# Altium schematic sheet 02-DAC.schdoc
size 307 x 218 mm; Symbol: muban; Device: muban; @Project Name: 12345678; @Create Date: 2025-07-10; @Schematic Name: Mini Oscilloscope; @Page Count: 5; @Update Date: 2025-07-10; @Update Time: 15:23:32; @Page Name: 02-DAC; @Page No: 2; @Create Time: 07:22:24; @Board Name: Base Board; Title Block Position: 3; Width: 1170; Height: 825; Region Start: 1; X Region Count: 6; Y Region Count: 4; Blade Width: 10; Description: 模拟题模板
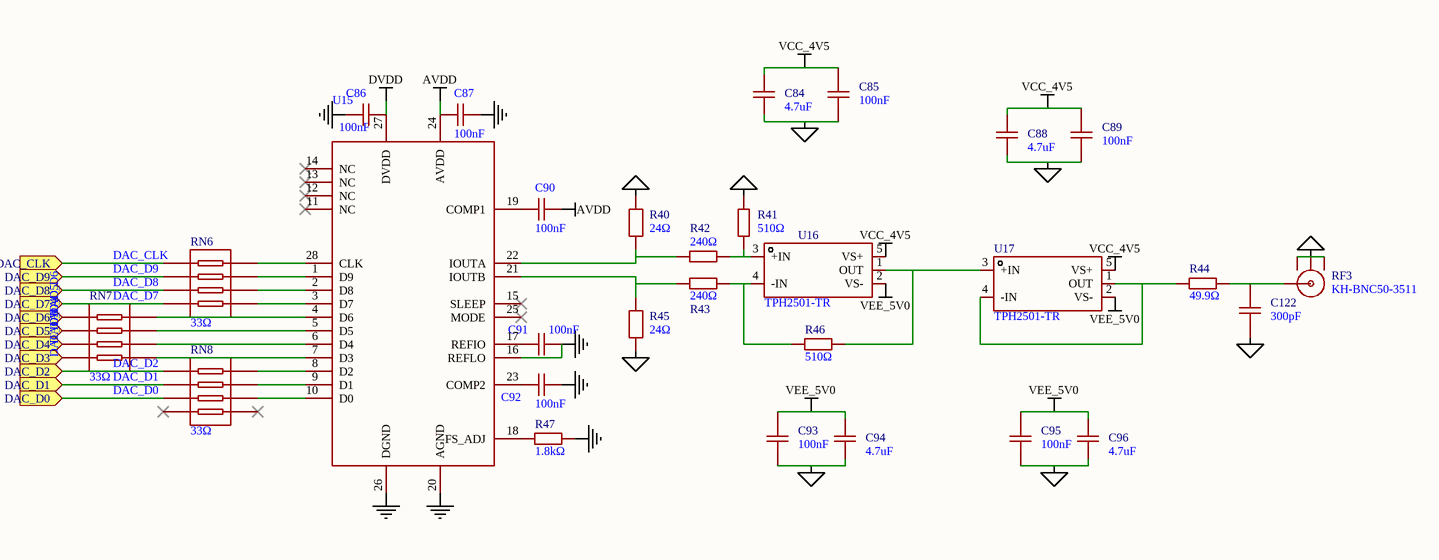
[diagram p0: 02-DAC.schdoc]

## Parts
C84  4.7uF  [C0603]
C85  100nF  [C0603]
C86  100nF  [C0603]
C87  100nF  [C0603]
C88  4.7uF  [C0603]
C89  100nF  [C0603]
C90  100nF  [C0603]
C91  100nF  [C0603]
C92  100nF  [C0603]
C93  100nF  [C0603]
C94  4.7uF  [C0603]
C95  100nF  [C0603]
C96  4.7uF  [C0603]
C122  300pF  [C0603]
R40  24Ω  [R0603]
R41  510Ω  [R0603]
R42  240Ω  [R0603]
R43  240Ω  [R0603]
R44  49.9Ω  [R0603]
R45  24Ω  [R0603]
R46  510Ω  [R0603]
R47  1.8kΩ  [R0603]
RF3  KH-BNC50-3511  [ANT-TH_KH-BNC50-3511]
RN6  33Ω  [RES-ARRAY-SMD_0603-8P-L3.2-W1.6-BL]
RN7  33Ω  [RES-ARRAY-SMD_0603-8P-L3.2-W1.6-BL]
RN8  33Ω  [RES-ARRAY-SMD_0603-8P-L3.2-W1.6-BL]
U15  (no value)  [TSSOP-28_L9.7-W4.4-P0.65-LS6.4-TR]
U16  TPH2501-TR  [SOT-23-5_L3.0-W1.7-P0.95-LS2.8-BR]
U17  TPH2501-TR  [SOT-23-5_L3.0-W1.7-P0.95-LS2.8-BR]

## Ports
DAC_CLK (in), DAC_D0 (in), DAC_D1 (in), DAC_D2 (in), DAC_D3 (in), DAC_D4 (in), DAC_D5 (in), DAC_D6 (in), DAC_D7 (in), DAC_D8 (in), DAC_D9 (in)

## Nets
AGND: C84.1 C85.1 C88.1 C89.1 C93.1 C94.1 C95.1 C96.1 C122.1 R40.2 R41.2 R45.1 RF3.2 RF3.3 RF3.4
AVDD: C87.2 C90.1 U15.24(AVDD)
DVDD: C86.2 U15.27(DVDD)
GND: C86.1 C87.1 C91.1 C92.1 R47.2 U15.16(REFLO) U15.20(AGND) U15.26(DGND)
VCC_4V5: C84.2 C85.2 C88.2 C89.2 U16.5(VS+) U17.5(VS+)
VEE_5V0: C93.2 C94.2 C95.2 C96.2 U16.2(VS-) U17.2(VS-)
DAC_CLK: RN6.5 ; port DAC_CLK
DAC_D0: RN8.3 ; port DAC_D0
DAC_D1: RN8.2 ; port DAC_D1
DAC_D2: RN8.1 ; port DAC_D2
DAC_D3: RN7.4 ; port DAC_D3
DAC_D4: RN7.3 ; port DAC_D4
DAC_D5: RN7.2 ; port DAC_D5
DAC_D6: RN7.1 ; port DAC_D6
DAC_D7: RN6.8 ; port DAC_D7
DAC_D8: RN6.7 ; port DAC_D8
DAC_D9: RN6.6 ; port DAC_D9
NetC90_2: C90.2 U15.19(COMP1)
NetC91_2: C91.2 U15.17(REFIO)
NetC92_2: C92.2 U15.23(COMP2)
NetC122_2: C122.2 R44.2 RF3.1(OUT)
NetR40_1: R40.1 R42.1 U15.22(IOUTA)
NetR41_1: R41.1 R42.2 U16.3(+IN)
NetR43_1: R43.1 R45.2 U15.21(IOUTB)
NetR43_2: R43.2 R46.1 U16.4(-IN)
NetR44_1: R44.1 U17.1(OUT) U17.4(-IN)
NetR46_2: R46.2 U16.1(OUT) U17.3(+IN)
NetR47_1: R47.1 U15.18(FS_ADJ)
NetRN6_1: RN6.1 U15.3(D7)
NetRN6_2: RN6.2 U15.2(D8)
NetRN6_3: RN6.3 U15.1(D9)
NetRN6_4: RN6.4 U15.28(CLK)
NetRN7_5: RN7.5 U15.7(D3)
NetRN7_6: RN7.6 U15.6(D4)
NetRN7_7: RN7.7 U15.5(D5)
NetRN7_8: RN7.8 U15.4(D6)
NetRN8_6: RN8.6 U15.10(D0)
NetRN8_7: RN8.7 U15.9(D1)
NetRN8_8: RN8.8 U15.8(D2)

Not connected (* = marked no-connect by the designer): RN8 4* 5*; U15 11(NC)* 12(NC)* 13(NC)* 14(NC)* 15(SLEEP)* 25(MODE)*

## Notes on the sheet
- 1
- 2
- 3
- 4
- 5
- 6
- A
- B
- C
- D

## Library data of the parts
C84 C88 C94 C96 = CL10A475KO8NNNC: Manufacturer: SAMSUNG(三星); Add into BOM: yes; Tolerance: ±10%; Voltage Rated: 16V; Temperature Coefficient: X5R; Symbol: CL10A475KO8NNNC; Device: CL10A475KO8NNNC; LCSC Part Name: 4.7uF ±10% 16V; Supplier Part: C19666; Manufacturer Part: CL10A475KO8NNNC; Supplier Footprint: 0603; JLCPCB Part Class: Basic Part; Datasheet: https://atta.szlcsc.com/upload/public/pdf/source/20160218/1457707763339.pdf; Supplier: LCSC; Convert to PCB: yes; Value: 4.7uF
C85 C89 C93 C95 = CGA0603X7R104K500JT: Manufacturer: HRE(芯声); Symbol: CC0603KRX7R9BB104; Add into BOM: yes; Tolerance: ±10%; Voltage Rated: 50V; Temperature Coefficient: X7R; Device: CGA0603X7R104K500JT; LCSC Part Name: 100nF ±10% 50V; Supplier Part: C6119867; Manufacturer Part: CGA0603X7R104K500JT; Supplier Footprint: 0603; JLCPCB Part Class: Extended Part; Datasheet: https://atta.szlcsc.com/upload/public/pdf/source/20250103/C44077DA9E7B3EFAE02F22B6D3D1CBC9.pdf; Supplier: LCSC; Convert to PCB: yes; Value: 100nF; Voltage Rating: 50V
C86 C87 C90-C92 = CGA0603X7R104K500JT: Manufacturer: HRE(芯声); Symbol: GCM155R71C104KA40D; Add into BOM: yes; Tolerance: ±10%; Voltage Rated: 50V; Temperature Coefficient: X7R; Device: CGA0603X7R104K500JT; LCSC Part Name: 100nF ±10% 50V; Supplier Part: C6119867; Manufacturer Part: CGA0603X7R104K500JT; Supplier Footprint: 0603; JLCPCB Part Class: Extended Part; Datasheet: https://atta.szlcsc.com/upload/public/pdf/source/20250103/C44077DA9E7B3EFAE02F22B6D3D1CBC9.pdf; Supplier: LCSC; Convert to PCB: yes; Value: 100nF; Voltage Rating: 50V
C122 = CC0603JRNPO9BN301: Manufacturer: YAGEO(国巨); Add into BOM: yes; Tolerance: ±5%; Voltage Rated: 50V; Temperature Coefficient: NP0; Symbol: CC0603JRNPO9BN301; Device: CC0603JRNPO9BN301; LCSC Part Name: 300pF ±5% 50V; Supplier Part: C519401; Manufacturer Part: CC0603JRNPO9BN301; Supplier Footprint: 0603; JLCPCB Part Class: 扩展库; Datasheet: https://atta.szlcsc.com/upload/public/pdf/source/20200423/C519401_2047077801E3794C35D33CD0926CFD8F.pdf; Supplier: LCSC; Convert to PCB: yes; Value: 300pF
R40 R45 = FRC0603F24R0TS: Manufacturer: FOJAN(富捷); Add into BOM: yes; Tolerance: ±1%; Power(Watts): 100mW; Overload Voltage (Max): 75V; Temperature Coefficient: ±100ppm/℃; Symbol: FRC0603F24R0TS; Device: FRC0603F24R0TS; LCSC Part Name: 24Ω ±1% 100mW 厚膜电阻; Supplier Part: C2907018; Manufacturer Part: FRC0603F24R0TS; Supplier Footprint: 0603; JLCPCB Part Class: 扩展库; Datasheet: https://atta.szlcsc.com/upload/public/pdf/source/20211221/925EC7D7225764EE0046F22065062C87.pdf; Supplier: LCSC; Convert to PCB: yes; Type: 厚膜电阻; Value: 24Ω; Operating Temperature Range: -55℃~+155℃
R41 R46 = 0603WAF5100T5E: Manufacturer: UNI-ROYAL(厚声); Add into BOM: yes; Tolerance: ±1%; Power(Watts): 100mW; Overload Voltage (Max): 75V; Temperature Coefficient: ±100ppm/℃; Symbol: 0603WAF5100T5E; Device: 0603WAF5100T5E; LCSC Part Name: 510Ω ±1% 100mW 厚膜电阻; Supplier Part: C23193; Manufacturer Part: 0603WAF5100T5E; Supplier Footprint: 0603; JLCPCB Part Class: 基础库; Datasheet: https://atta.szlcsc.com/upload/public/pdf/source/20200306/C422600_1E6D84923E4A46A82E41ADD87F860B5C.pdf; Supplier: LCSC; Convert to PCB: yes; Type: 厚膜电阻; Value: 510Ω; Operating Temperature Range: -55℃~+155℃
R42 R43 = 0603WAF2400T5E: Manufacturer: UNI-ROYAL(厚声); Add into BOM: yes; Tolerance: ±1%; Power(Watts): 100mW; Overload Voltage (Max): 75V; Temperature Coefficient: ±100ppm/℃; Symbol: 0603WAF2400T5E; Device: 0603WAF2400T5E; LCSC Part Name: 240Ω ±1% 100mW 厚膜电阻; Supplier Part: C23350; Manufacturer Part: 0603WAF2400T5E; Supplier Footprint: 0603; JLCPCB Part Class: 扩展库; Datasheet: https://atta.szlcsc.com/upload/public/pdf/source/20200306/C422600_1E6D84923E4A46A82E41ADD87F860B5C.pdf; Supplier: LCSC; Convert to PCB: yes; Type: 厚膜电阻; Value: 240Ω; Operating Temperature Range: -55℃~+155℃
R44 = 0603WAF499JT5E: Manufacturer: UNI-ROYAL(厚声); Add into BOM: yes; Tolerance: ±1%; Power(Watts): 100mW; Overload Voltage (Max): 75V; Temperature Coefficient: ±100ppm/℃; Symbol: 0603WAF499JT5E; Device: 0603WAF499JT5E; LCSC Part Name: 49.9Ω ±1% 100mW 厚膜电阻; Supplier Part: C23185; Manufacturer Part: 0603WAF499JT5E; Supplier Footprint: 0603; JLCPCB Part Class: 基础库; Datasheet: https://atta.szlcsc.com/upload/public/pdf/source/20200306/C422600_1E6D84923E4A46A82E41ADD87F860B5C.pdf; Supplier: LCSC; Convert to PCB: yes; Type: 厚膜电阻; Value: 49.9Ω; Operating Temperature Range: -55℃~+155℃
R47 = 0603WAF1801T5E: Manufacturer: UNI-ROYAL(厚声); Add into BOM: yes; Tolerance: ±1%; Power(Watts): 100mW; Overload Voltage (Max): 75V; Temperature Coefficient: ±100ppm/℃; Symbol: 0603WAF1801T5E; Device: 0603WAF1801T5E; LCSC Part Name: 1.8kΩ ±1% 100mW 厚膜电阻; Supplier Part: C4177; Manufacturer Part: 0603WAF1801T5E; Supplier Footprint: 0603; JLCPCB Part Class: 基础库; Datasheet: https://atta.szlcsc.com/upload/public/pdf/source/20200306/C422600_1E6D84923E4A46A82E41ADD87F860B5C.pdf; Supplier: LCSC; Convert to PCB: yes; Type: 厚膜电阻; Value: 1.8kΩ; Operating Temperature Range: -55℃~+155℃
RF3 = KH-BNC50-3511: Manufacturer: kinghelm(金航标); Add into BOM: yes; Connector Type: 板端; Interface Type: 内孔; Number of Ports: 1; Interface Diameter: 9.5mm; Frequency-Max: 3GHz; RF Series: BNC; Impedance: 50Ω; Style: 弯头; Symbol: KH-BNC50-3511; Device: KH-BNC50-3511; LCSC Part Name: BNC 内孔 弯头; Supplier Part: C2837587; Manufacturer Part: KH-BNC50-3511; Supplier Footprint: 插件; JLCPCB Part Class: 扩展库; Datasheet: https://atta.szlcsc.com/upload/public/pdf/source/20221123/AFF24A942BB0EF6B7776F494013BE75C.pdf; Supplier: LCSC; Convert to PCB: yes; Interface Length/Height: -; Operating Temperature Range: -55℃~+155℃
RN6-RN8 = 4D03WGJ0330T5E: Manufacturer: UNI-ROYAL(厚声); Add into BOM: yes; Number of Resistors: 4; Tolerance: ±5%; Power(Watts): 62.5mW; Temperature Coefficient: ±200ppm/℃; Symbol: 4D03WGJ0330T5E; Device: 4D03WGJ0330T5E; LCSC Part Name: 33Ω ±5%; Supplier Part: C25508; Manufacturer Part: 4D03WGJ0330T5E; Supplier Footprint: 0603x4; JLCPCB Part Class: 扩展库; Datasheet: https://atta.szlcsc.com/upload/public/pdf/source/20191224/C474318_2527498AE30E813171187CCD28401A71.pdf; Supplier: LCSC; Convert to PCB: yes; Value: 33Ω; Number of Pins: 8
U15 = 3PD5651: Symbol: 3PD5651E; Convert to PCB: yes; Device: 3PD5651; Add into BOM: yes; Datasheet: http://file.3peakic.com.cn:8080/product/Datasheet_3PD5651E.pdf
U16 U17 = TPH2501-TR: Manufacturer: 3PEAK(思瑞浦); Add into BOM: yes; Number of Channels: 单路; Maximum Power Supply Range (Vdd-Vss): 5.5V; Rail to Rail: 轨到轨输入,轨到轨输出; Gain Bandwidth Product: 120MHz; Vos - Input Offset Voltage: 50uV; Input Offset Voltage Drift(Vos TC): 2uV/℃; Slew Rate: 180V/us; Ib - Input Bias Current: 0.3pA; Noise density(eN): 6.5nV/√Hz@1MHz; Common Mode Rejection Ratio(CMRR): 85dB; Quiescent Current: 6.5mA; Symbol: TPH2501-TR; Device: TPH2501-TR; LCSC Part Name: TPH2501-TR; Supplier Part: C126713; Manufacturer Part: TPH2501-TR; Supplier Footprint: SOT-23-5; JLCPCB Part Class: 扩展库; Datasheet: https://atta.szlcsc.com/upload/public/pdf/source/20180820/C248592_EC92046997BE718B1CFA256C8CC8079C.pdf; Supplier: LCSC; Convert to PCB: yes; Operating Temperature: -40℃~+125℃